# EAGLE design 293_01 (EAGLE 6.5.0)
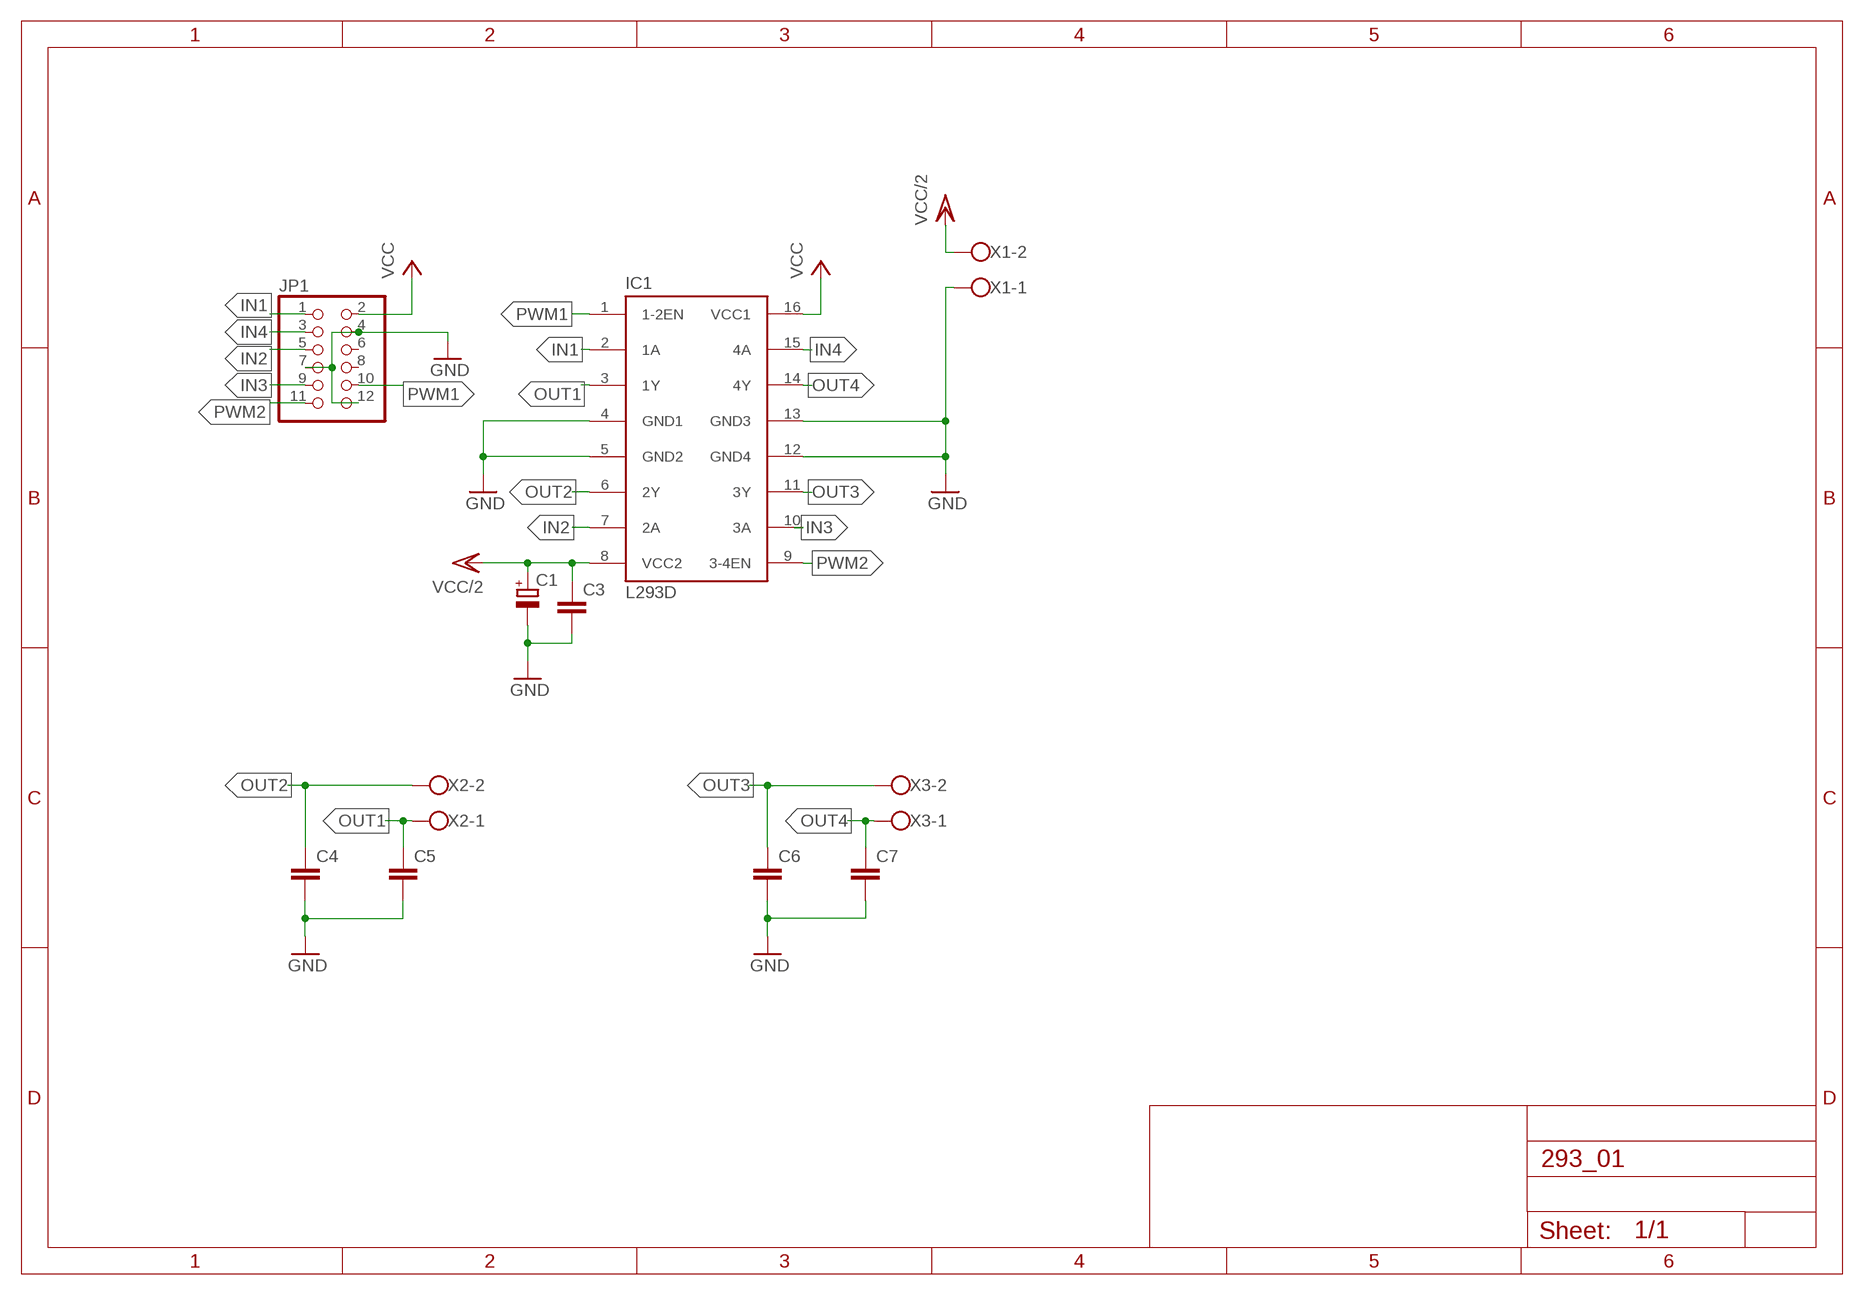
[diagram p0: schematic, sheet 1]

## Parts
C1  CPOL-EUE2.5-7  [E2,5-7]
C3  C-EUC1206  [C1206]
C4  C-EUC1206  [C1206]
C5  C-EUC1206  [C1206]
C6  C-EUC1206  [C1206]
C7  C-EUC1206  [C1206]
IC1  L293D  [DIL16]
JP1  PINHD-2X6  [2X06]
X1  W237-102  [W237-102]
X2  W237-102  [W237-102]
X3  W237-102  [W237-102]

## Nets
GND: C1.- C3.2 C4.2 C5.2 C6.2 C7.2 IC1.4(GND1) IC1.5(GND2) IC1.12(GND4) IC1.13(GND3) JP1.4 JP1.7 JP1.12 X1.1
IN1: IC1.2(1A) JP1.1
IN2: IC1.7(2A) JP1.5
IN3: IC1.10(3A) JP1.9
IN4: IC1.15(4A) JP1.3
OUT1: C5.1 IC1.3(1Y) X2.1
OUT2: C4.1 IC1.6(2Y) X2.2
OUT3: C6.1 IC1.11(3Y) X3.2
OUT4: C7.1 IC1.14(4Y) X3.1
PWM1: IC1.1(1-2EN) JP1.10
PWM2: IC1.9(3-4EN) JP1.11
VCC: IC1.16(VCC1) JP1.2
VCC/2: C1.+ C3.1 IC1.8(VCC2) X1.2
Unconnected: JP1.6 JP1.8

## Library data of the parts
C1 = rcl:CPOL-EU: POLARIZED CAPACITOR, European symbol
C3-C7 = rcl:C-EU: CAPACITOR, European symbol
IC1 = st-microelectronics:L293D: PUSH-PULL 4 CHANNEL DRIVER; MPN: L293D; OC_FARNELL: 9589619; OC_NEWARK: 56P8249
JP1 = pinhead:PINHD-2X6: PIN HEADER
X1-X3 = con-wago-500:W237-102: WAGO SCREW CLAMP; MPN: 237-102; OC_FARNELL: unknown; OC_NEWARK: 70K9898

## Board
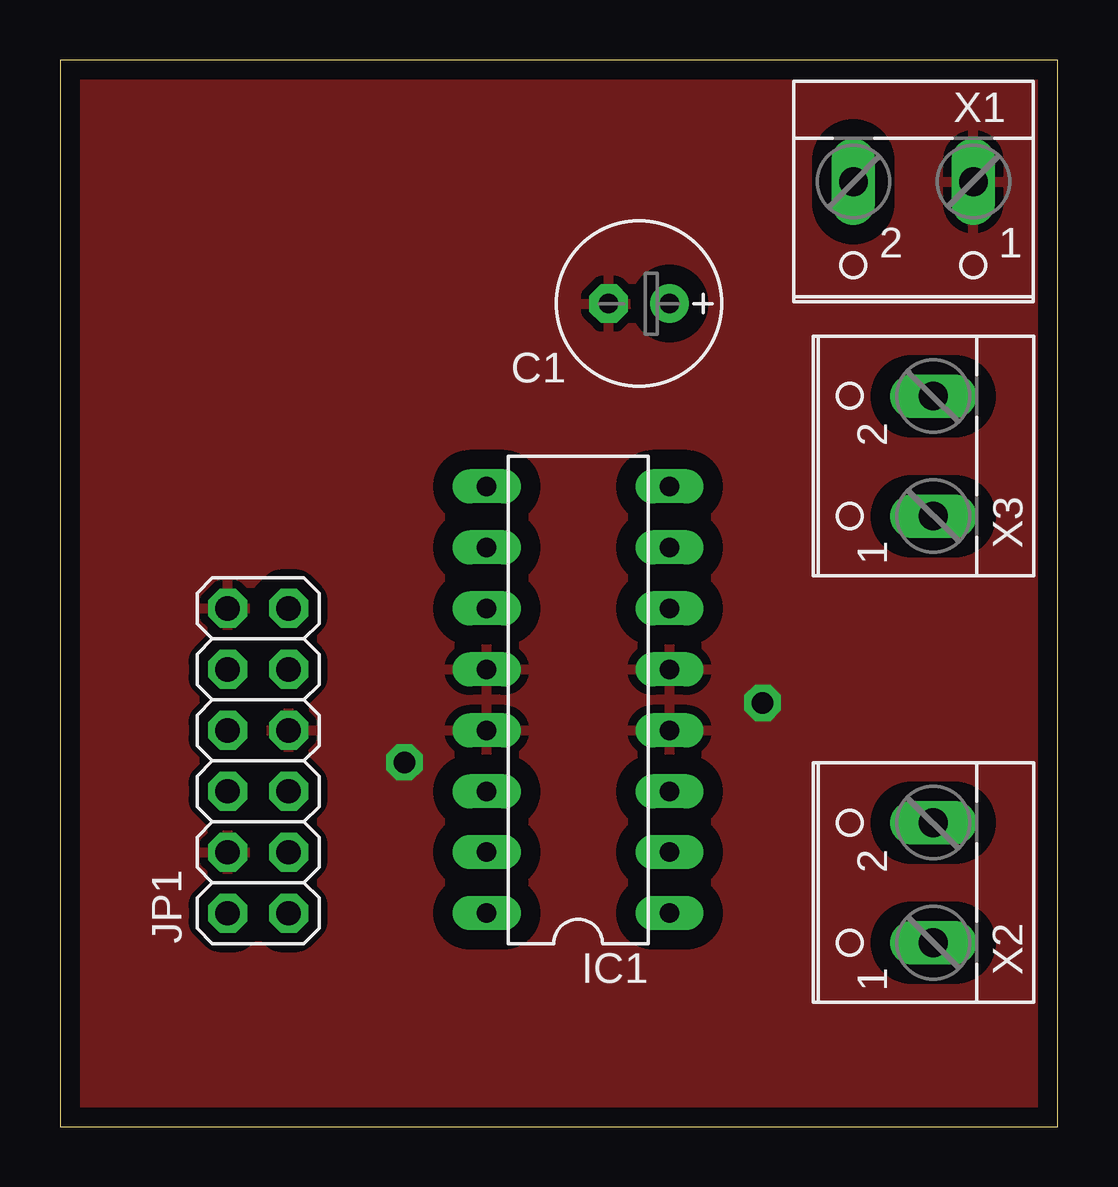
[diagram p1: board, top side]
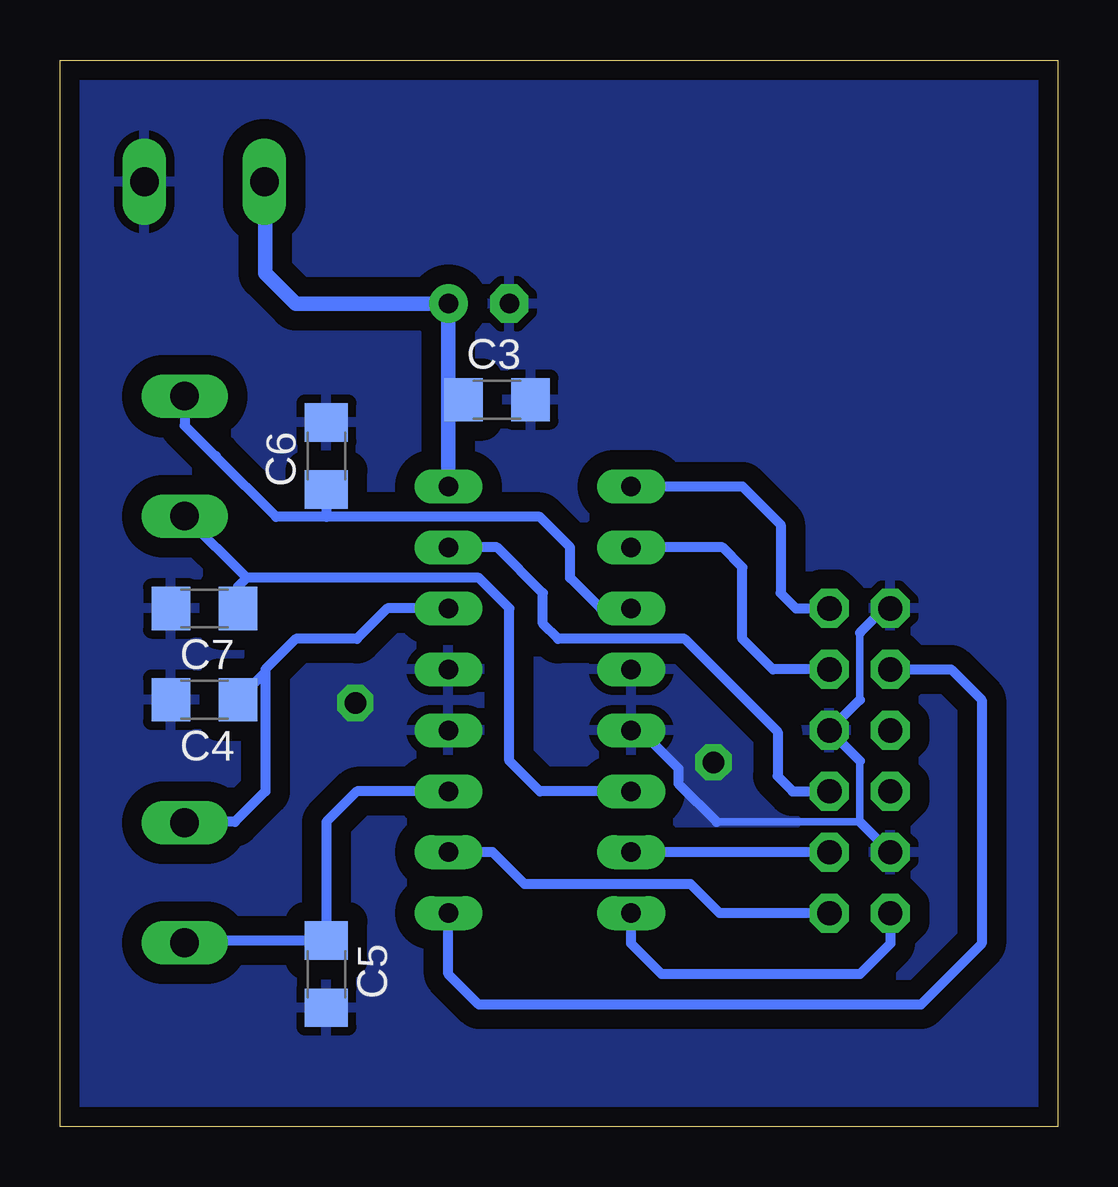
[diagram p2: board, bottom side, seen from below]

Size 41.58 x 44.44 mm. Coordinates in mm from the lower left corner, seen from the top.
Outline: 0,0 41.58,0 41.58,44.44 0,44.44 0,0
Copper layers (1*16): Top 0.035mm / dielectric 1.5mm / Bottom 0.035mm
Design rules "default *": minimum track width 10mil, minimum drill 24mil, track to track 8mil, track to pad 8mil, pad to pad 8mil, via to via 8mil, smd to smd 8mil, copper to edge 1mil, drill to drill 10mil, minimum pad ring 12mil, minimum via ring 12mil, stop-mask expansion 4mil, vias tented up to drill 0mil, thermal gap 14mil

### Footprints (pad centres in the part's own frame; a part is rotated, then mirrored left to right if it is on the bottom)
E2,5-7 = drill 0.813 pad 1.6: + -1.27,0 | drill 0.813 pad 1.6 octagon: - 1.27,0
C1206 = smd 1.6 x 1.8: 1 -1.4,0; 2 1.4,0
DIL16 = drill 0.813 long: 1 -8.89,-3.81; 2 -6.35,-3.81; 3 -3.81,-3.81; 4 -1.27,-3.81; 5 1.27,-3.81; 6 3.81,-3.81; 7 6.35,-3.81; 8 8.89,-3.81; 9 8.89,3.81; 10 6.35,3.81; 11 3.81,3.81; 12 1.27,3.81; 13 -1.27,3.81; 14 -3.81,3.81; 15 -6.35,3.81; 16 -8.89,3.81
2X06 = drill 1.016 octagon: 1 -6.35,-1.27; 2 -6.35,1.27; 3 -3.81,-1.27; 4 -3.81,1.27; 5 -1.27,-1.27; 6 -1.27,1.27; 7 1.27,-1.27; 8 1.27,1.27; 9 3.81,-1.27; 10 3.81,1.27; 11 6.35,-1.27; 12 6.35,1.27
W237-102 = drill 1.194 long: 1 -2.5,-1.27; 2 2.5,-1.27

### Placement (x,y rotation side)
C1  24.13,34.29 180 top
C3  23.37,30.29 0 bottom
C4  35.56,17.78 180 bottom
C5  30.48,6.35 270 bottom
C6  30.48,27.94 90 bottom
C7  35.56,21.59 180 bottom
IC1  21.59,17.78 90 top
JP1  8.26,15.24 90 top
X1  35.56,38.1 180 top
X2  35.12,10.16 90 top
X3  35.12,27.94 90 top

### Tracks (layer width: path | path; a pad name or v marks a point on that pad's centre or on a via)
GND  (via drill 0.9)
  Bottom 0.305: 8.26,15.24 8.26,12.7 14.22,12.7 | 8.26,20.57 8.26,17.78
  Bottom 0.406: JP1.4 8.26,12.7 | 8.26,15.24 JP1.7 8.26,17.78 | JP1.12 7.24,21.59 8.26,20.57 | IC1.13 17.4,16.51 15.81,14.92 15.81,14.29 14.22,12.7
  other vias: 29.27,17.65 14.35,15.18
  pour Bottom (isolate 0.813): -2.54,45.72 44.45,45.72 44.45,-1.27 -2.54,-1.27
  pour Top (isolate 0.813): -1.97,45.21 43.12,45.21 43.12,0.13 -1.97,0.13
IN1
  Bottom 0.406: JP1.1 14.1,8.89 15.3,10.1 22.23,10.1 23.56,11.43 IC1.2
IN2
  Bottom 0.406: IC1.7 23.37,24.13 21.46,22.22 21.46,20.95 20.83,20.32 15.56,20.32 11.68,16.45 11.68,14.61 11.05,13.97 JP1.5
IN3
  Bottom 0.406: JP1.9 11.87,19.05 13.14,20.32 13.14,23.3 13.97,24.13 IC1.10
IN4
  Bottom 0.406: JP1.3 IC1.15
N$1
  pour Top: 1.27,43.18 25.4,43.18 25.4,38.1 24.13,36.83 20.32,35.56 20.32,33.02 1.27,30.48
OUT1
  Bottom 0.406: IC1.3 29.21,13.97 30.48,12.7 C5.1 36.3,7.75 X2.1
OUT2
  Bottom 0.406: IC1.6 27.94,21.59 29.21,20.32 31.75,20.32 33.02,19.05 33.02,18.92 | 33.02,18.92 33.02,13.97 34.29,12.7 36.35,12.7 X2.2 | 33.02,18.92 C4.1
OUT3
  Bottom 0.406: IC1.11 19.05,21.59 20.32,22.86 20.32,24.13 21.59,25.4 30.48,25.4 | 30.48,25.4 32.58,25.4 35.12,27.94 | 35.12,27.94 35.08,27.94 | X3.2 36.39,29.21 35.12,27.94 | C6.1 30.48,25.4
OUT4
  Bottom 0.406: IC1.14 21.59,13.97 22.86,15.24 22.86,21.59 24.13,22.86 33.81,22.86 | X3.1 33.81,22.86 | C7.1 34.16,22.5 33.81,22.86
PWM1
  Bottom 0.406: JP1.10 4.45,19.05 3.17,17.78 3.17,7.62 5.71,5.08 24.13,5.08 25.4,6.35 IC1.1
PWM2
  Bottom 0.406: IC1.9 13.14,26.67 11.56,25.08 11.56,22.22 10.92,21.59 JP1.11
VCC
  Bottom 0.406: JP1.2 6.99,7.62 8.26,6.35 16.51,6.35 17.78,7.62 IC1.16
VCC/2
  Bottom 0.406: 33.02,39.33 X1.2 | 25.4,30.35 25.34,30.29 C3.1
  Bottom 0.61: 33.02,39.33 33.02,35.56 31.75,34.29 C1.+ 25.4,30.35 IC1.8

### Text on the board
tRestrict: gpRacing / 2014